# Altium schematic sheet Regulator.SchDoc
size A; SheetNumber: 9; SheetTotal: 9
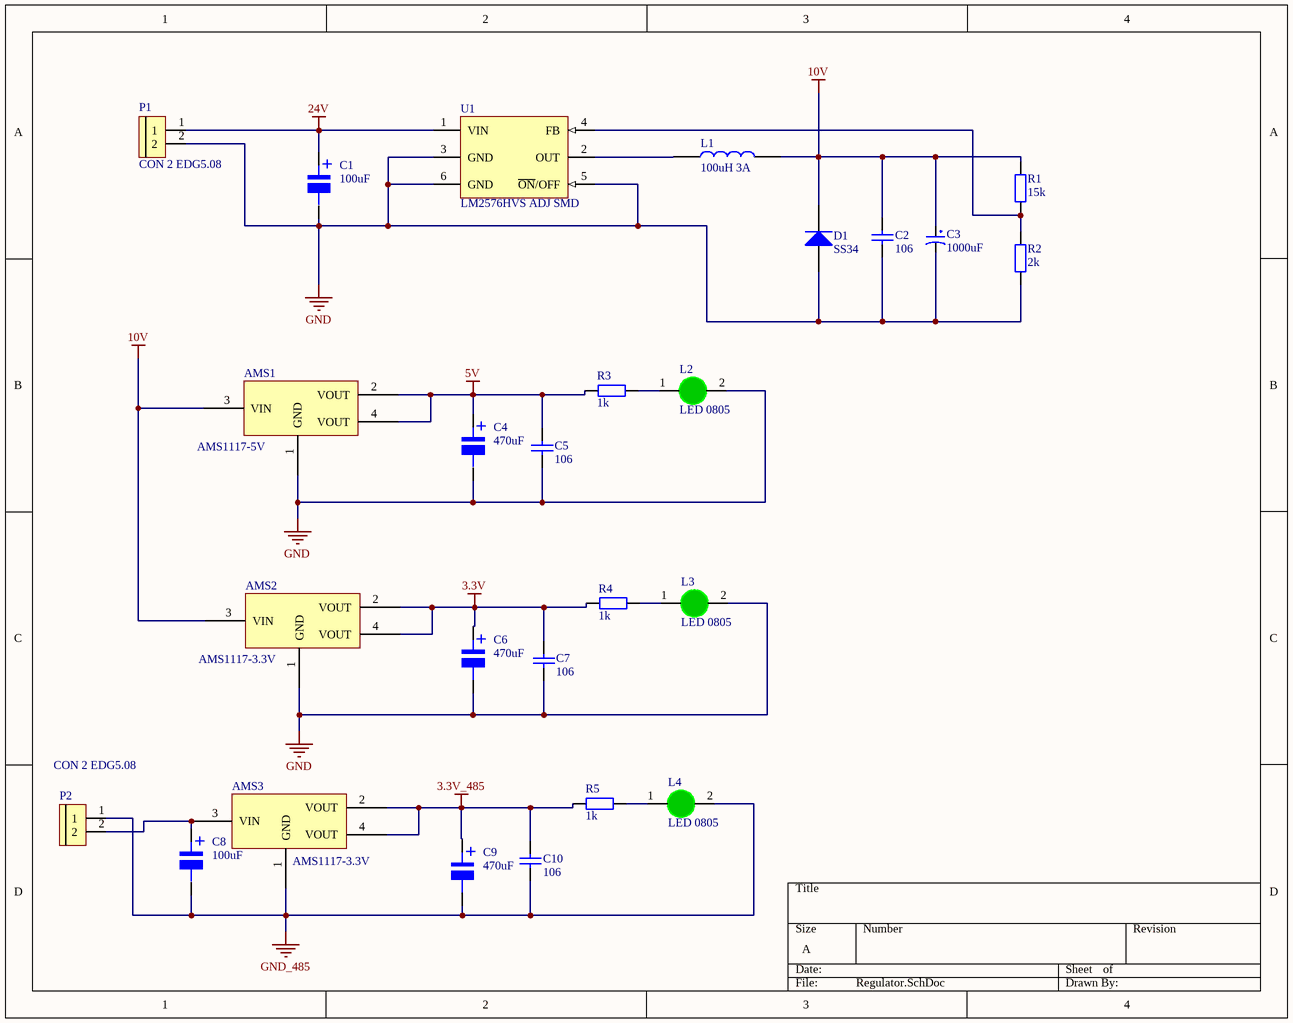
[diagram p0: Regulator.SchDoc]

## Parts
AMS1  AMS1117-5V  [SOT223]
AMS2  AMS1117-3.3V  [SOT223]
AMS3  AMS1117-3.3V  [SOT223]
C1  100uF  [tu nhom 8 (f)]
C2  106  [tu 0805]
C3  1000uF  [tu hoa 13mm]
C4  470uF  [tu nhom 10 (G)]
C5  106  [tu 0805]
C6  470uF  [tu nhom 10 (G)]
C7  106  [tu 0805]
C8  100uF  [tu nhom 8 (f)]
C9  470uF  [tu nhom 10 (G)]
C10  106  [tu 0805]
D1  SS34  [DIODE SMA]
L1  100uH 3A  [CUON CAM 100uH3A]
L2  LED 0805  [LED-0805-Green]
L3  LED 0805  [LED-0805-Green]
L4  LED 0805  [LED-0805-Green]
P1  CON 2 EDG5.08  [CON 2 2EDG5.08]
P2  CON 2 EDG5.08  [CON 2 2EDG5.08]
R1  15k  [tro smd 0805]
R2  2k  [tro smd 0805]
R3  1k  [tro smd 0805]
R4  1k  [tro smd 0805]
R5  1k  [tro smd 0805]
U1  LM2576HVS ADJ SMD  [TO263-5]

## Nets
3.3V: AMS2.2(VOUT) AMS2.4(VOUT) C6.1 C7.1 R4.1
3.3V_485: AMS3.2(VOUT) AMS3.4(VOUT) C9.1 C10.1 R5.1
5V: AMS1.2(VOUT) AMS1.4(VOUT) C4.1 C5.1 R3.1
10V: AMS1.3(VIN) AMS2.3(VIN) C2.1 C3.1 D1.2(K) L1.2 R1.1
24V: C1.1 P1.1 U1.1(VIN)
GND: AMS1.1(GND) AMS2.1(GND) C1.2 C2.2 C3.2 C4.2 C5.2 C6.2 C7.2 D1.1(A) L2.2(K) L3.2(K) P1.2 R2.1 U1.3(GND) U1.5(~{ON}/OFF) U1.6(GND)
GND_485: AMS3.1(GND) C8.2 C9.2 C10.2 L4.2(K) P2.1
NetAMS3_3: AMS3.3(VIN) C8.1 P2.2
NetL1_1: L1.1 U1.2(OUT)
NetL2_1: L2.1(A) R3.2
NetL3_1: L3.1(A) R4.2
NetL4_1: L4.1(A) R5.2
NetR1_2: R1.2 R2.2 U1.4(FB)

## Notes on the sheet
- (in symbol Tu Nhom 100uF 50V) +
- (in symbol Tu Nhom 470uF 35V) +

## Library data of the parts
AMS1-AMS3 = AMS1117 SMD: Dán; Value: AMS1117-3.3V SOT223; Don_Vi: Con; Ma_Hang: MH000596; Ghi_Chu: *; Kieu_Chan: *; Chung_Loai: Dán
C1 C8 = Tu Nhom 100uF 50V: Dán; Don_Vi: Con; So_Chan: 2; Ten_Linh_Kien: Tụ Nhôm 100uF 50V 8x10.2MM; Ma_Hang: MH002223; Chung_Loai: Dán; Kieu_Chan: *
C2 C5 C7 C10 = Tu 0805 106 16V 10%: Dán; Ten_Linh_Kien: Tụ 0805 106-10uF 10% 16V; So_Chan: 2; Don_Vi: Con; Ma_Hang: MH004553; Chung_Loai: Dán; Kieu_Chan: *
C3 = Tu Hoa 1000uF 25V 13x21: Cắm; Don_Vi: Con; So_Chan: 2; Ten_Linh_Kien: Tụ Hóa 1000uF 25V 13x21MM; Ma_Hang: MH002315; Chung_Loai: Cắm; Kieu_Chan: *
C4 C6 C9 = Tu Nhom 470uF 35V: Dán; Don_Vi: Con; So_Chan: 2; Ten_Linh_Kien: Tụ Nhôm 470uF 35V 10x10.5MM; Ma_Hang: MH004418; Chung_Loai: Dán; Kieu_Chan: *
D1 = Diode SS34 ( 1N5822 ): Dán; Don_Vi: Con; Ma_Hang: MH002104; Ten_Linh_Kien: Diode SS34 3A 40V SMA ( 1N5822 SS34A); Kieu_Chan: *; Chung_Loai: Dán
L1 = CUON CAM 100uH DIP: Dán; Don_Vi: Con; Ma_Hang: MH002209; Ten_Linh_Kien: Cuộn Cảm 100uH 3A 8x10MM; Chung_Loai: Dán; Ghi Chu: *; Kieu Chan: *
L2-L4 = LED 0805 Xanh La: Dán; Don_Vi: Con; Ma_Hang: MH002326; Ten_Linh_Kien: LED 0805 Màu Xanh Lá (Green); Ghi_Chu: *; Kieu_Chan: *; Chung_Loai: Dán
P1 P2 = CON 2 EDG5.08: Cắm; Ten_Linh_Kien: CON 2 2EDG5.08-2P 5.08MM ( Xanh Cong); Ma_Hang: MH000759; Ghi_Chu: *; Don_Vi: Con; Kieu_Chan: *; Chung_Loai: Cắm
R1 = Tro 0805 1% 15k: Dán; Don_Vi: Con; So_Chan: 2; Ten_Linh_Kien: Trở 0805 1% 15k; Ma_Hang: MH005476; Chung_Loai: Dán; Kieu_Chan: *
R2 = Tro 0805 1% 2k: Dán; Don_Vi: Con; So_Chan: 2; Ten_Linh_Kien: Trở 0805 1% 2k; Ma_Hang: MH005471; Chung_Loai: Dán; Kieu_Chan: *
R3-R5 = Tro 0805 5% 1k: Dán; Don_Vi: Con; So_Chan: 2; Ten_Linh_Kien: Trở 0805 5% 1k; Ma_Hang: MH005234; Chung_Loai: Dán; Kieu_Chan: *
U1 = LM2576HVS ADJ SMD: Dán; Ten_Linh_Kien: LM2576HVS-ADJ BUCK ADJ 3A TO263-5; Don_Vi: Con; Ma_Hang: MH002361; Ghi_Chu: *; Kieu_Chan: *; Chung_Loai: Dán